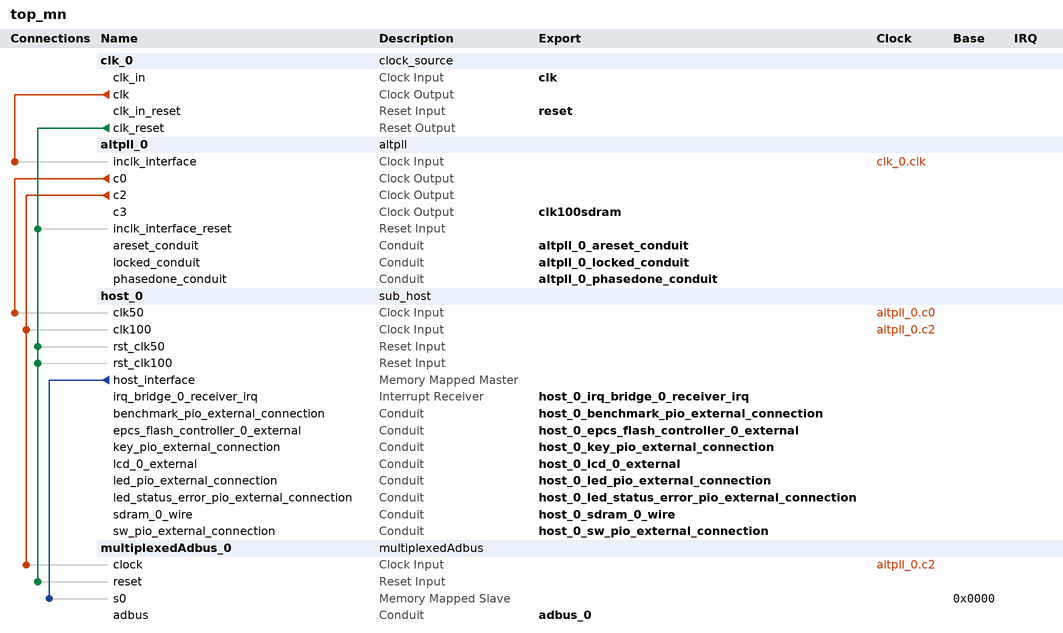
[diagram p0: system contents]
# Platform Designer (Qsys) system top_mn, Cyclone IV E EP4CE115F29C7
# Parameters at their usual value, and those the tool derives, are not listed.
package require -exact qsys 12.1
create_system top_mn
set_project_property DEVICE_FAMILY {Cyclone IV E}
set_project_property DEVICE EP4CE115F29C7

add_instance clk_0 clock_source 12.1
set_instance_parameter_value clk_0 clockFrequency 50000000

add_instance altpll_0 altpll 12.1
set_instance_parameter_value altpll_0 INCLK0_INPUT_FREQUENCY 20000
set_instance_parameter_value altpll_0 CLK0_MULTIPLY_BY 1
set_instance_parameter_value altpll_0 CLK2_MULTIPLY_BY 2
set_instance_parameter_value altpll_0 CLK3_MULTIPLY_BY 2
set_instance_parameter_value altpll_0 CLK0_DIVIDE_BY 1
set_instance_parameter_value altpll_0 CLK2_DIVIDE_BY 1
set_instance_parameter_value altpll_0 CLK3_DIVIDE_BY 1
set_instance_parameter_value altpll_0 CLK2_PHASE_SHIFT 0
set_instance_parameter_value altpll_0 CLK3_PHASE_SHIFT -1389
set_instance_parameter_value altpll_0 CLK2_DUTY_CYCLE 50
set_instance_parameter_value altpll_0 CLK3_DUTY_CYCLE 50
set_instance_parameter_value altpll_0 PORT_clk1 PORT_UNUSED
set_instance_parameter_value altpll_0 PORT_clk2 PORT_USED
set_instance_parameter_value altpll_0 PORT_clk3 PORT_USED
set_instance_parameter_value altpll_0 PORT_ARESET PORT_UNUSED
set_instance_parameter_value altpll_0 PORT_LOCKED PORT_USED

add_instance host_0 sub_host 1.0

add_instance multiplexedAdbus_0 multiplexedAdbus 0.0.1

# connections
add_connection altpll_0.c0 host_0.clk50 clock
add_connection altpll_0.c2 host_0.clk100 clock
add_connection altpll_0.c2 multiplexedAdbus_0.clock clock
add_connection clk_0.clk altpll_0.inclk_interface clock
add_connection clk_0.clk_reset altpll_0.inclk_interface_reset reset
add_connection clk_0.clk_reset host_0.rst_clk50 reset
add_connection clk_0.clk_reset host_0.rst_clk100 reset
add_connection clk_0.clk_reset multiplexedAdbus_0.reset reset
add_connection host_0.host_interface multiplexedAdbus_0.s0 avalon
set_connection_parameter_value host_0.host_interface/multiplexedAdbus_0.s0 baseAddress 0x0000

# exported interfaces
add_interface clk clock sink
set_interface_property clk EXPORT_OF clk_0.clk_in
add_interface reset reset sink
set_interface_property reset EXPORT_OF clk_0.clk_in_reset
add_interface clk100sdram clock source
set_interface_property clk100sdram EXPORT_OF altpll_0.c3
add_interface altpll_0_areset_conduit conduit end
set_interface_property altpll_0_areset_conduit EXPORT_OF altpll_0.areset_conduit
add_interface altpll_0_locked_conduit conduit end
set_interface_property altpll_0_locked_conduit EXPORT_OF altpll_0.locked_conduit
add_interface altpll_0_phasedone_conduit conduit end
set_interface_property altpll_0_phasedone_conduit EXPORT_OF altpll_0.phasedone_conduit
add_interface host_0_sw_pio_external_connection conduit end
set_interface_property host_0_sw_pio_external_connection EXPORT_OF host_0.sw_pio_external_connection
add_interface host_0_key_pio_external_connection conduit end
set_interface_property host_0_key_pio_external_connection EXPORT_OF host_0.key_pio_external_connection
add_interface host_0_led_pio_external_connection conduit end
set_interface_property host_0_led_pio_external_connection EXPORT_OF host_0.led_pio_external_connection
add_interface host_0_lcd_0_external conduit end
set_interface_property host_0_lcd_0_external EXPORT_OF host_0.lcd_0_external
add_interface host_0_epcs_flash_controller_0_external conduit end
set_interface_property host_0_epcs_flash_controller_0_external EXPORT_OF host_0.epcs_flash_controller_0_external
add_interface host_0_sdram_0_wire conduit end
set_interface_property host_0_sdram_0_wire EXPORT_OF host_0.sdram_0_wire
add_interface host_0_benchmark_pio_external_connection conduit end
set_interface_property host_0_benchmark_pio_external_connection EXPORT_OF host_0.benchmark_pio_external_connection
add_interface host_0_led_status_error_pio_external_connection conduit end
set_interface_property host_0_led_status_error_pio_external_connection EXPORT_OF host_0.led_status_error_pio_external_connection
add_interface host_0_irq_bridge_0_receiver_irq interrupt receiver
set_interface_property host_0_irq_bridge_0_receiver_irq EXPORT_OF host_0.irq_bridge_0_receiver_irq
add_interface adbus_0 conduit end
set_interface_property adbus_0 EXPORT_OF multiplexedAdbus_0.adbus

save_system top_mn.qsys
